# Altium schematic sheet Sheet1.SchDoc
size A4
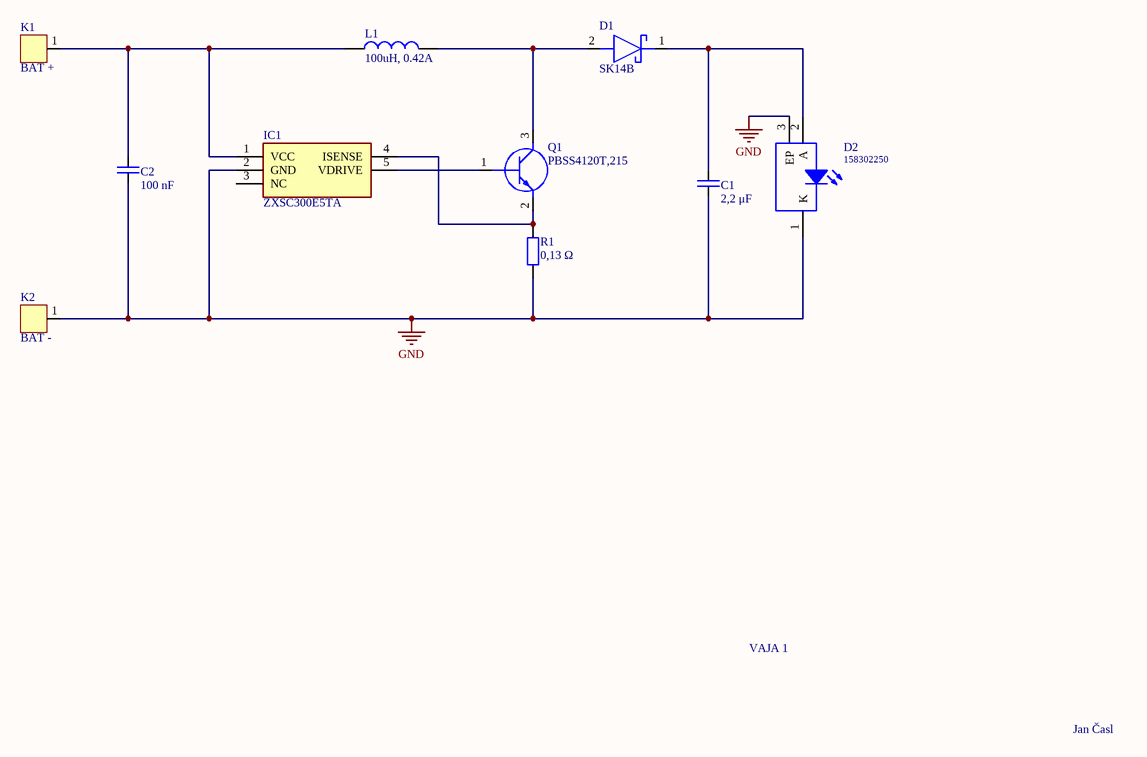
[diagram p0: Sheet1.SchDoc]

## Parts
C1  2,2 μF  [C2012_0805I_M]
C2  100 nF  [C2012_0805I_M]
D1  SK14B  [DIOM5236X261N]
D2  158302250  [WL-SWTP_3022_L3W2.1H0.8]
IC1  ZXSC300E5TA  [SOT95P270X145-5N]
K1  BAT +  [H1x1]
K2  BAT -  [H1x1]
L1  100uH, 0.42A  [WE-LQFS_4818]
Q1  PBSS4120T,215  [SOT95P230X110-3N]
R1  0,13 Ω  [R2012_0805I_M]

## Nets
GND: C1.2 C2.2 D2.1(K) D2.3(EP) IC1.2(GND) K2.1 R1.2
NetC1_1: C1.1 D1.1(K) D2.2(A)
NetC2_1: C2.1 IC1.1(VCC) K1.1 L1.1
NetD1_2: D1.2(A) L1.2 Q1.3(C)
NetIC1_4: IC1.4(ISENSE) Q1.2(E) R1.1
NetIC1_5: IC1.5(VDRIVE) Q1.1(B)

Not connected (* = marked no-connect by the designer): IC1 3(NC)

## Notes on the sheet
- VAJA 1
- Jan Časl

## Library data of the parts
C1 C2 = C: Capacitor
D1 = SK14B: Schottky Diode; Manufacturer_Name: Taiwan Semiconductor; Datasheet Link: http://docs-emea.rs-online.com/webdocs/0897/0900766b8089796b.pdf; Height: 2.61mm; Manufacturer_Part_Number: SK14B; Mouser Part Number: 821-SK14B; Mouser Price/Stock: https://www.mouser.com/Search/Refine.aspx?Keyword=821-SK14B
D2 = 158302250: WL-SWTP SMT White Top view PLCC, size 3022, Daylight, 3.2V, 120deg; Manufacturer: Wurth Elektronik; Color Rendering Index typ.: 85; Chip Technology: InGaN; Correlated Color Temperature typ.: 5000K; Luminous Flux typ.: 22lm; ComponentLink1Description: Manufacturer; ComponentLink1URL: http://www.we-online.de; ComponentLink2URL: https://www.we-online.com/catalog/datasheet/158302250.pdf; ComponentLink2Description: Datasheet; Forward Voltage typ.: 3.2V; Emitting Color: Daylight; Mounting Technology: SMT; Operating Temperature: -40 to +85degC; Manufacturer Part Number: 158302250; Packaging: Tape and Reel; Published Date: September 2020; Viewing Angle: 120deg; Size: 3022
IC1 = ZXSC300E5TA: Integrated Circuit; Manufacturer_Name: Diodes Inc.; Datasheet Link: https://componentsearchengine.com/Datasheets/2/ZXSC300E5TA.pdf; Height: 1.45mm; Manufacturer_Part_Number: ZXSC300E5TA; Arrow Part Number: ZXSC300E5TA; Arrow Price/Stock: https://www.arrow.com/en/products/zxsc300e5ta/diodes-incorporated; Mouser Part Number: 522-ZXSC300E5TA; Mouser Price/Stock: https://www.mouser.co.uk/ProductDetail/Diodes-Incorporated/ZXSC300E5TA?qs=OlC7AqGiEDmawYEYAFJ1vw%3D%3D
K1 K2 = H1x1: Header 1x1 (male)
L1 = 74406042101: WE-LQFS SMT Power Inductor, size 4818, 100uH, 0.42A; Manufacturer: Wurth Elektronik; Self Resonant Frequency: 15MHz; DC Resistance typ.: 1155mOhm; DC Resistance max.: 1386mOhm; Saturation Current: 0.32A; ComponentLink1Description: Manufacturer; ComponentLink1URL: http://www.we-online.de; ComponentLink2Description: Datasheet; ComponentLink2URL: https://www.we-online.com/catalog/datasheet/74406042101.pdf; Mounting Technology: SMT; Operating Temperature: -40 to +125degC; Packaging: Tape and Reel; Published Date: April 2020; Inductance: 100uH; Manufacturer Part Number: 74406042101; Rated Current: 0.42A; Size: 4818
Q1 = PBSS4120T,215: Transistor BJT NPN; Manufacturer_Name: Nexperia; Datasheet Link: http://assets.nexperia.com/documents/data-sheet/PBSS4120T.pdf; Height: 1.1mm; Manufacturer_Part_Number: PBSS4120T,215; Arrow Part Number: PBSS4120T,215; Arrow Price/Stock: https://www.arrow.com/en/products/pbss4120t215/nexperia; Mouser Part Number: 771-PBSS4120T215; Mouser Price/Stock: https://www.mouser.co.uk/ProductDetail/Nexperia/PBSS4120T215?qs=LOCUfHb8d9syLy2%252BT0L8uQ%3D%3D
R1 = R: Value: R13